# EAGLE design MiniDual_FanSpansion (EAGLE 7.3.0)
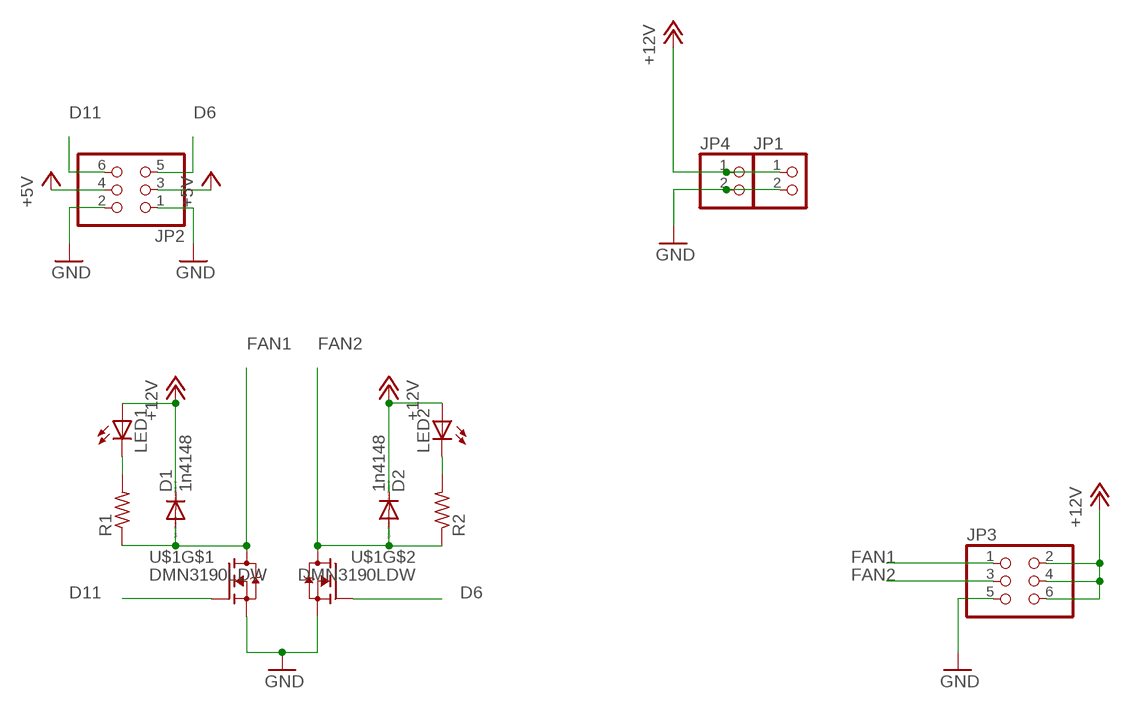
[diagram p0: schematic, sheet 1]

## Parts
D1  1n4148  DIODE-SOD323-R  [SOD323-R]
D2  1n4148  DIODE-SOD323-R  [SOD323-R]
JP1  PINHD-1X2  [1X02]
JP2  PINHD-2X3  [2X03]
JP3  PINHD-2X3  [2X03]
JP4  PINHD-1X2  [1X02]
LED1  LEDSML0805  [SML0805]
LED2  LEDSML0805  [SML0805]
R1  R-US_R0805  [R0805]
R2  R-US_R0805  [R0805]
U$1  DMN3190LDW  [SOT65P210X110-6N]

## Nets
+5V: JP2.3 JP2.4
+12V: D1.C D2.C JP1.1 JP3.2 JP3.4 JP3.6 JP4.1 LED1.A LED2.A
D6: JP2.5 U$1.2(G)
D11: JP2.6 U$1.5(G)
FAN1: D1.A JP3.1 R1.1 U$1.3(D)
FAN2: D2.A JP3.3 R2.1 U$1.6(D)
GND: JP1.2 JP2.1 JP2.2 JP3.5 JP4.2 U$1.1(S) U$1.4(S)
N$1: LED1.C R1.2
N$2: LED2.C R2.2

## Library data of the parts
D1 D2 = diode:DIODE-: DIODE
JP1 JP4 = pinhead:PINHD-1X2: PIN HEADER
JP2 JP3 = pinhead:PINHD-2X3: PIN HEADER
LED1 LED2 = led:LED: LED OSRAM: - CHIPLED LG R971, LG N971, LY N971, LG Q971, LY Q971, LO R971, LY R971 LH N974, LH R974 LS Q976, LO Q976, LY Q976 LO Q996 - Hyper CHIPLED LW Q18S LB Q993, LB Q99A, LB R99A - SideLED LS A670, LO A670, LY A670, LG A670, LP A670 LB A673, LV A673, LT A673, LW A673 LH A674 LY A675 LS A676, LA A676, LO A676, LY A676, LW A676 LS A679, LY A679, LG A679 - Hyper Micro SIDELED® LS Y876, LA Y876, LO Y876, LY Y876 LT Y87S - SmartLED LW L88C, LW L88S LB L89C, LB L89S, LG L890 LS L89K, LO L89K, LY L89K LS L896, LA L896, LO L896, LY L896 - TOPLED LS T670, LO T670, LY T670, LG T670, LP T670 LSG T670, LSP T670, LSY T670, LOP T670, LYG T670 LG T671, LOG T671, LSG T671 LB T673, LV T673, LT T673, LW T673 LH T674 LS T676, LA T676, LO T676, LY T676, LB T676, LH T676, LSB T676, LW T676 LB T67C, LV T67C, LT T67C, LS T67K, LO T67K, LY T67K, LW E67C LS E67B, LA E67B, LO E67B, LY E67B, LB E67C, LV E67C, LT E67C LW T67C LS T679, LY T679, LG T679 LS T770, LO T770, LY T770, LG T770, LP T770 LB T773, LV T773, LT T773, LW T773 LH T774 LS E675, LA E675, LY E675, LS T675 LS T776, LA T776, LO T776, LY T776, LB T776 LHGB T686 LT T68C, LB T68C - Hyper Mini TOPLED® LB M676 - Mini TOPLED Santana® LG M470 LS M47K, LO M47K, LY M47K Source: http://www.osram.convergy.de LUXEON: - LUMILED® LXK2-PW12-R00, LXK2-PW12-S00, LXK2-PW14-U00, LXK2-PW14-V00 LXK2-PM12-R00, LXK2-PM12-S00, LXK2-PM14-U00 LXK2-PE12-Q00, LXK2-PE12-R00, LXK2-PE12-S00, LXK2-PE14-T00, LXK2-PE14-U00 LXK2-PB12-K00, LXK2-PB12-L00, LXK2-PB12-M00, LXK2-PB14-N00, LXK2-PB14-P00, LXK2-PB14-Q00 LXK2-PR12-L00, LXK2-PR12-M00, LXK2-PR14-Q00, LXK2-PR14-R00 LXK2-PD12-Q00, LXK2-PD12-R00, LXK2-PD12-S00 LXK2-PH12-R00, LXK2-PH12-S00 LXK2-PL12-P00, LXK2-PL12-Q00, LXK2-PL12-R00 Source: www.luxeon.com KINGBRIGHT: KA-3528ASYC Source: www.kingbright.com
R1 R2 = resistor:R-US_: RESISTOR, American symbol
U$1 = RobThePyro:DMN3190LDW

## Board
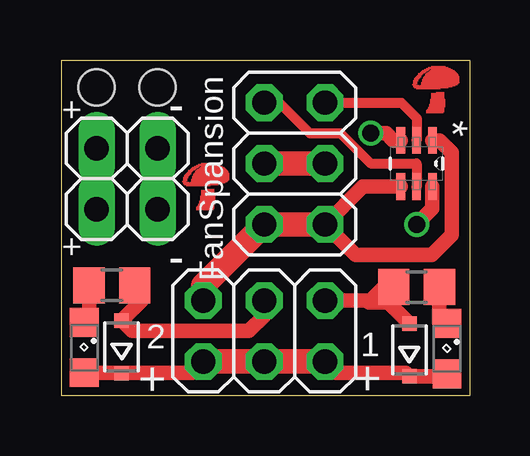
[diagram p1: board, top side]
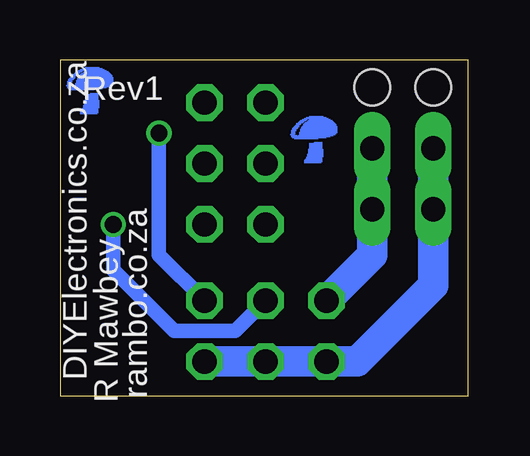
[diagram p2: board, bottom side, seen from below]

Size 17 x 14 mm. Coordinates in mm from the lower left corner, seen from the top.
Outline: 0,0 0,14 17,14 17,0 0,0
Copper layers (1*16): Top 0.035mm / dielectric 1.5mm / Bottom 0.035mm
Design rules "dirt_cheap_dirty_boards.v1": minimum track width 5mil, minimum drill 12mil, track to track 5mil, track to pad 5mil, pad to pad 5mil, via to via 5mil, smd to smd 0mil, copper to edge 10mil, drill to drill 10mil, minimum pad ring 10mil, minimum via ring 6mil, stop-mask expansion 2mil, vias tented up to drill 25mil, thermal gap 10mil
Holes 1.5 mm at 1.45,12.85 3.99,12.85

### Footprints (pad centres in the part's own frame; a part is rotated, then mirrored left to right if it is on the bottom)
SOD323-R = smd 0.6 x 0.6: A 1.1,0; C -1.1,0
1X02 = drill 1.016 long: 1 -1.27,0; 2 1.27,0
2X03 = drill 1.016 octagon: 1 -2.54,-1.27; 2 -2.54,1.27; 3 0,-1.27; 4 0,1.27; 5 2.54,-1.27; 6 2.54,1.27
SML0805 = smd 1.2 x 1.2: A 1.05,0; C -1.05,0
R0805 = smd 1.3 x 1.5: 1 -0.95,0; 2 0.95,0
SOT65P210X110-6N = smd 1.118 x 0.356: 1 -0.965,0.66; 2 -0.965,0; 3 -0.965,-0.66; 4 0.965,-0.66; 5 0.965,0; 6 0.965,0.66

### Placement (x,y rotation side)
D1  14.48,1.91 90 top
D2  2.49,2.03 90 top
JP1  2.72,7.77 0 top
JP2  9.7,9.68 90 top
JP3  8.43,2.69 180 top
JP4  2.72,10.31 0 top
LED1  16.05,1.96 270 top
LED2  0.94,2.01 270 top
R1  14.78,4.52 0 top
R2  2.08,4.6 180 top
U$1  14.78,9.68 270 top

### Tracks (layer width: path | path; a pad name or v marks a point on that pad's centre or on a via)
+5V
  Top 1.016: JP2.3 JP2.4
+12V
  Top 0.61: JP3.2 11.44,0.96 14.33,0.96 D1.C 15.95,0.81 LED1.A | LED2.A 3.35,0.96 | 3.35,0.96 D2.C | JP3.6 5.43,0.96 3.35,0.96
  Top 1.016: JP3.6 JP3.4 JP3.2
  Bottom 1.27: JP3.2 JP3.4 JP3.6 4.62,1.42 1.45,4.6 JP1.1 JP4.1
D6
  Top 0.406: JP2.5 14.15,12.22 14.78,11.58 U$1.2
D11
  Top 0.406: JP2.6 9.07,12.22 10.34,10.95 11.61,10.95 12.88,9.68 14.78,9.68 U$1.5
FAN1  (via drill 0.7)
  Top 0.61: U$1.3 13.82,10.64 13.51,10.95 v12.88,10.95 | JP3.1 12.71,3.96 12.79,3.88 | R1.1 13.44,4.52 12.79,3.88 | 12.79,3.88 13.61,3.88 D1.A
  Bottom 0.61: v12.88,10.95 12.88,5.87 JP3.1
FAN2  (via drill 0.7)
  Top 0.61: U$1.6 15.44,7.8 v14.78,7.14 | JP3.3 8.43,3.33 7.8,2.69 2.93,2.69 D2.A 3.35,4 3.35,4.28 R2.1
  Bottom 0.61: v14.78,7.14 14.78,5.23 12.24,2.69 9.7,2.69 JP3.3
GND
  Top 0.61: U$1.4 12.55,8.71 JP2.1 12.24,5.87 15.42,5.87 16.26,6.71 16.26,10.13 15.75,10.64 U$1.1
  Top 1.016: JP3.5 5.89,4.6 JP2.2 JP2.1
  Bottom 1.27: JP4.2 JP1.2 3.99,5.87 JP3.5
N$1
  Top 0.61: R1.2 15.73,3.04 LED1.C
N$2
  Top 0.61: R2.2 1.13,3.07 LED2.C
(copper drawn outside any net)
  shapes: Bottom area x122, Top area x122

### Text on the board
tNames: FanSpansion | + | - | + | - | 2 | 1 | + | +
bNames: Rev1 | rambo.co.za | R Mawbey | DIYElectronics.co.za